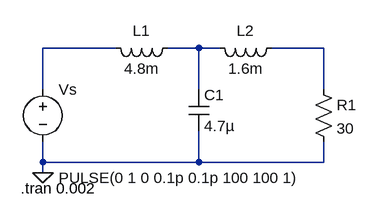
[diagram p0: schematic (3)step.asc]
(3)step.asc, the LTspice schematic file:
Version 4
SHEET 1 880 680
WIRE 112 48 0 48
WIRE 240 48 192 48
WIRE 272 48 240 48
WIRE 432 48 352 48
WIRE 0 112 0 48
WIRE 240 112 240 48
WIRE 432 112 432 48
WIRE 0 224 0 192
WIRE 240 224 240 176
WIRE 240 224 0 224
WIRE 432 224 432 192
WIRE 432 224 240 224
WIRE 0 240 0 224
FLAG 0 240 0
SYMBOL voltage 0 96 R0
WINDOW 3 24 152 Left 2
WINDOW 123 24 124 Left 2
WINDOW 39 0 0 Left 2
SYMATTR InstName Vs
SYMATTR Value PULSE(0 1 0 0.1p 0.1p 100 100 1)
SYMBOL ind 208 32 R90
WINDOW 0 5 56 VBottom 2
WINDOW 3 32 56 VTop 2
SYMATTR InstName L1
SYMATTR Value 4.8m
SYMBOL ind 368 32 R90
WINDOW 0 5 56 VBottom 2
WINDOW 3 32 56 VTop 2
SYMATTR InstName L2
SYMATTR Value 1.6m
SYMBOL res 416 96 R0
SYMATTR InstName R1
SYMATTR Value 30
SYMBOL cap 224 112 R0
SYMATTR InstName C1
SYMATTR Value 4.7µ
TEXT -34 264 Left 2 !.tran 0.002

The netlist it stands for:
* (3)step.asc
Vs N001 0 PULSE(0 1 0 0.1p 0.1p 100 100 1)
L1 N002 N001 4.8m
L2 N003 N002 1.6m
R1 N003 0 30
C1 N002 0 4.7µ
.tran 0.002
.backanno
.end